# EAGLE design C=Key (EAGLE 4.13)
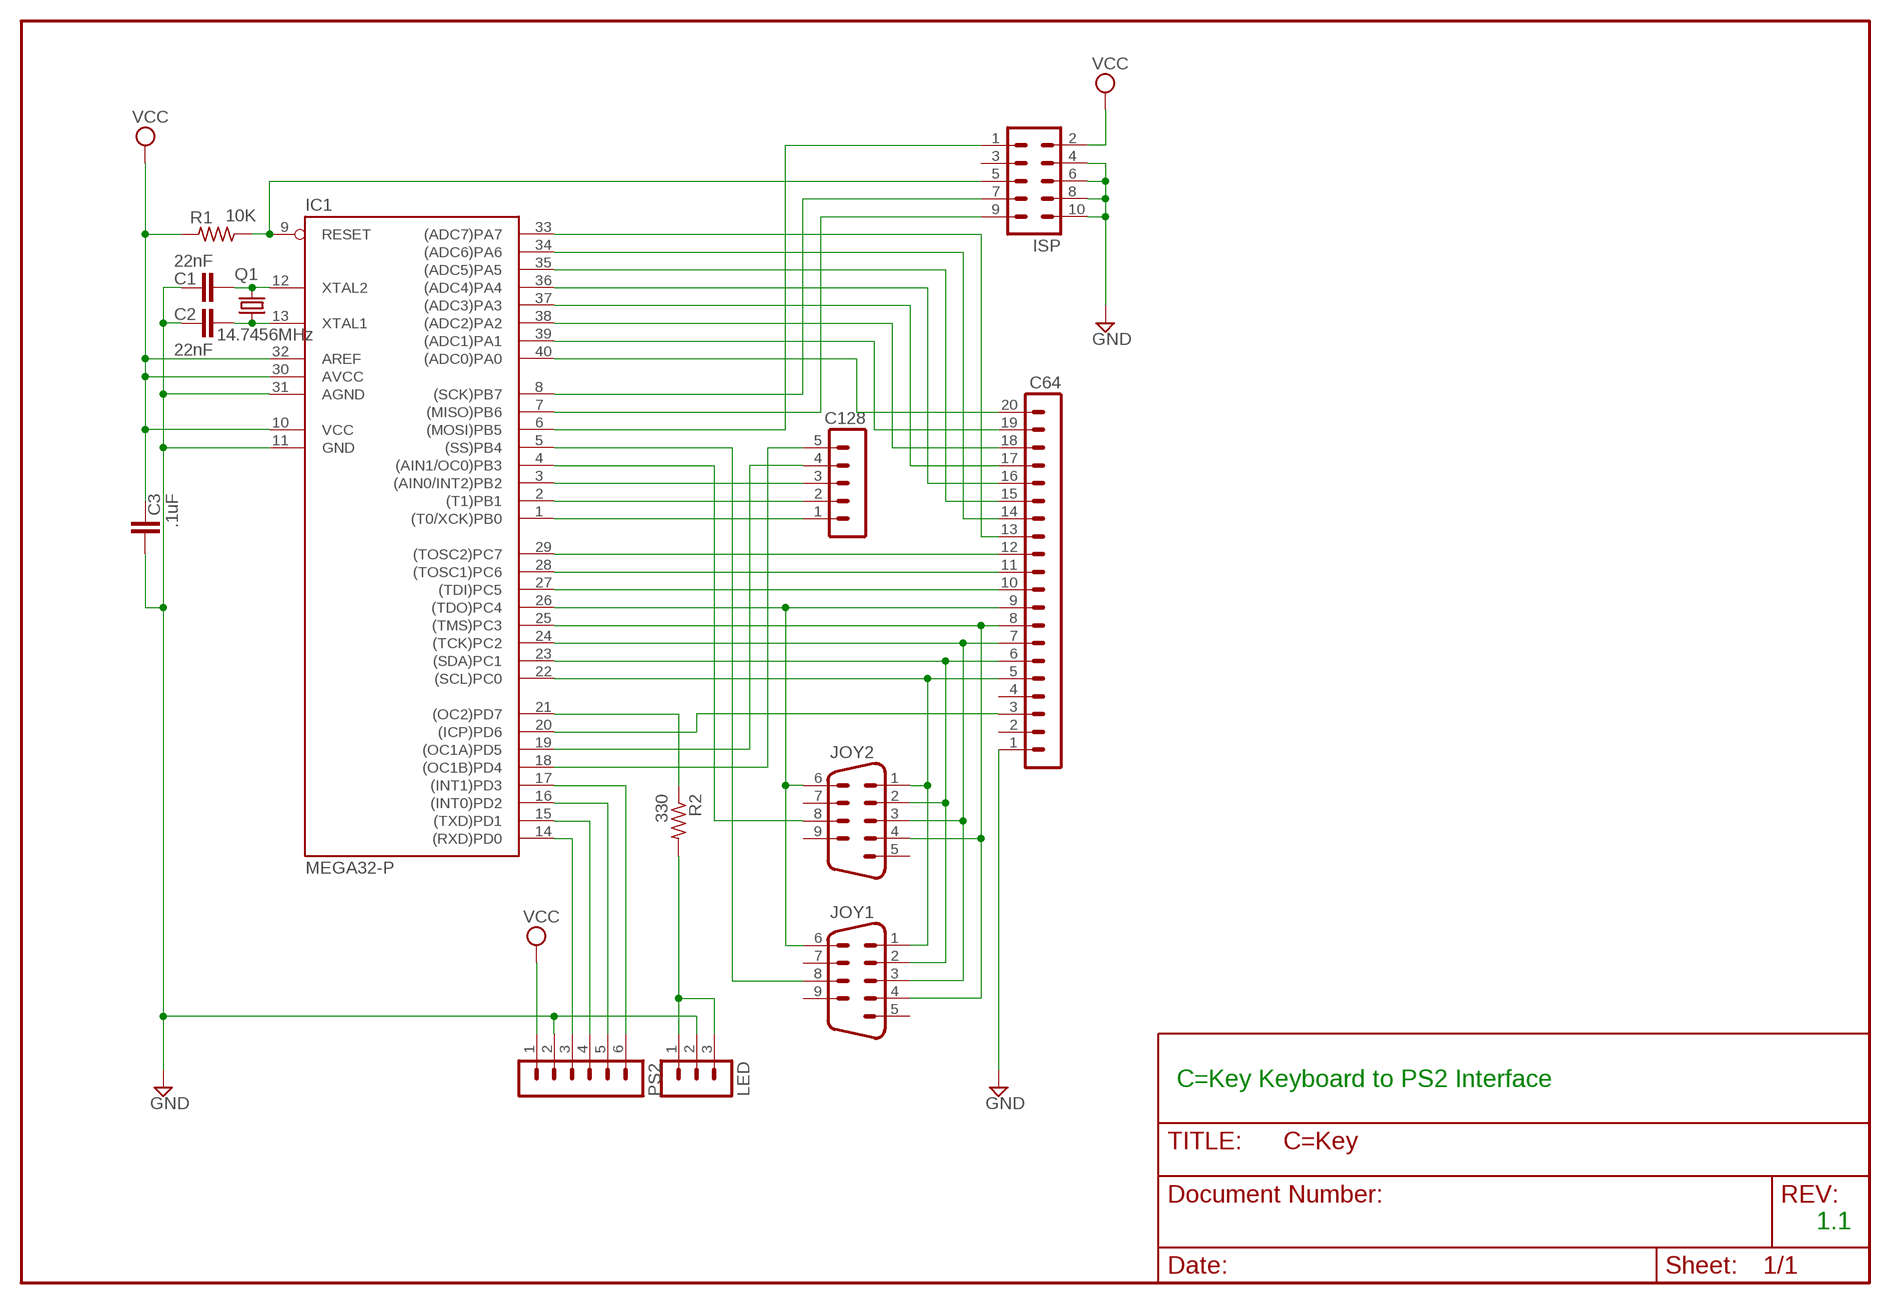
[diagram p0: schematic, sheet 1]

## Parts
C1  22nF  C2.5/2  [C2.5-2]
C2  22nF  C2.5/2  [C2.5-2]
C3  .1uF  C2.5/2  [C2.5-2]
C64  MA20-1  [MA20-1]
C128  MA05-1  [MA05-1]
IC1  MEGA32-P  [DIL40]
ISP  MA05-2  [MA05-2]
JOY1  M09H  [M09H]
JOY2  M09H  [M09H]
LED  MA03-1  [MA03-1]
PS2  MA06-1  [MA06-1]
Q1  14.7456MHz  CRYTALHC49U-V  [HC49U-V]
R1  10K  R-US_0613/5V  [P0613V]
R2  330  R-US_0613/5V  [P0613V]

## Nets
GND: C1.1 C2.1 C3.2 C64.1 IC1.11(GND) IC1.31(AGND) ISP.4 ISP.6 ISP.8 ISP.10 LED.2 PS2.2
N$1: C64.5 IC1.22((SCL)PC0) JOY1.1 JOY2.1
N$2: C64.6 IC1.23((SDA)PC1) JOY1.2 JOY2.2
N$3: C64.7 IC1.24((TCK)PC2) JOY1.3 JOY2.3
N$4: C64.8 IC1.25((TMS)PC3) JOY1.4 JOY2.4
N$5: C64.9 IC1.26((TDO)PC4) JOY1.6 JOY2.6
N$6: C64.10 IC1.27((TDI)PC5)
N$7: C64.11 IC1.28((TOSC1)PC6)
N$8: C64.12 IC1.29((TOSC2)PC7)
N$9: C64.13 IC1.33((ADC7)PA7)
N$10: C64.14 IC1.34((ADC6)PA6)
N$11: C64.15 IC1.35((ADC5)PA5)
N$12: C64.16 IC1.36((ADC4)PA4)
N$13: C64.17 IC1.37((ADC3)PA3)
N$14: C64.18 IC1.38((ADC2)PA2)
N$15: C64.19 IC1.39((ADC1)PA1)
N$16: C64.20 IC1.40((ADC0)PA0)
N$17: C128.1 IC1.1((T0/XCK)PB0)
N$18: C128.2 IC1.2((T1)PB1)
N$19: C128.3 IC1.3((AIN0/INT2)PB2)
N$20: IC1.4((AIN1/OC0)PB3) JOY2.8
N$21: IC1.5((SS)PB4) JOY1.8
N$22: IC1.14((RXD)PD0) PS2.3
N$23: IC1.15((TXD)PD1) PS2.4
N$24: IC1.16((INT0)PD2) PS2.5
N$25: IC1.17((INT1)PD3) PS2.6
N$26: C64.3 IC1.20((ICP)PD6)
N$27: C128.5 IC1.18((OC1B)PD4)
N$28: C128.4 IC1.19((OC1A)PD5)
N$29: IC1.9(RESET) ISP.5 R1.1
N$30: IC1.21((OC2)PD7) R2.1
N$31: C1.2 IC1.12(XTAL2) Q1.2
N$32: LED.1 LED.3 R2.2
N$34: C2.2 IC1.13(XTAL1) Q1.1
N$35: IC1.6((MOSI)PB5) ISP.1
N$36: IC1.8((SCK)PB7) ISP.7
N$37: IC1.7((MISO)PB6) ISP.9
VCC: C3.1 IC1.10(VCC) IC1.30(AVCC) IC1.32(AREF) ISP.2 PS2.1 R1.2
Unconnected: C64.2 C64.4 ISP.3 JOY1.5 JOY1.7 JOY1.9 JOY2.5 JOY2.7 JOY2.9

## Notes on the sheet
- C=Key Keyboard to PS2 Interface
- 1.1

## Library data of the parts
C1-C3 = capacitor-wima:C: CAPACITOR naming: grid - package width
C64 = con-lstb:MA20-1: PIN HEADER
C128 = con-lstb:MA05-1: PIN HEADER
IC1 = avr:MEGA32-P: MICROCONTROLLER 32 Kbytes FLASH 2 Kbytes SRAM 1 Kbytes EEPROM USART 8-channel 10 bit ADC
ISP = con-lstb:MA05-2: PIN HEADER
JOY1 JOY2 = con-subd:M09: SUB-D
LED = con-lstb:MA03-1: PIN HEADER
PS2 = con-lstb:MA06-1: PIN HEADER
Q1 = crystal:CRYTAL: CRYSTAL
R1 R2 = rcl:R-US_: RESISTOR, American symbol

## Board
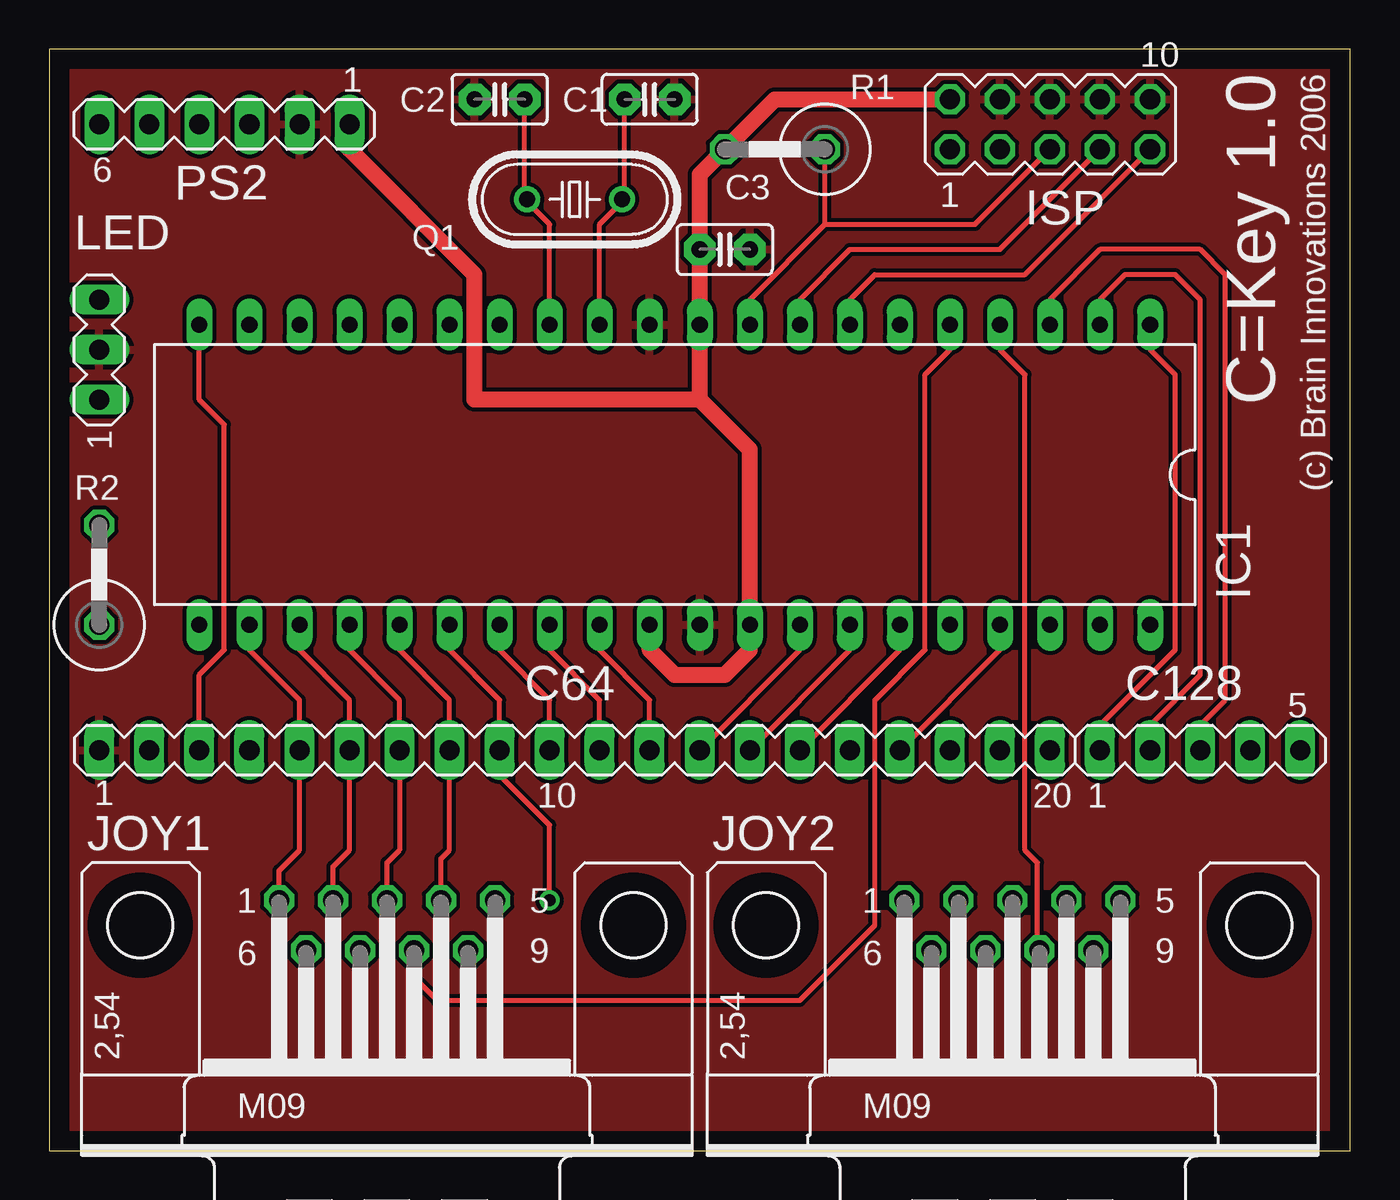
[diagram p1: board, top side]
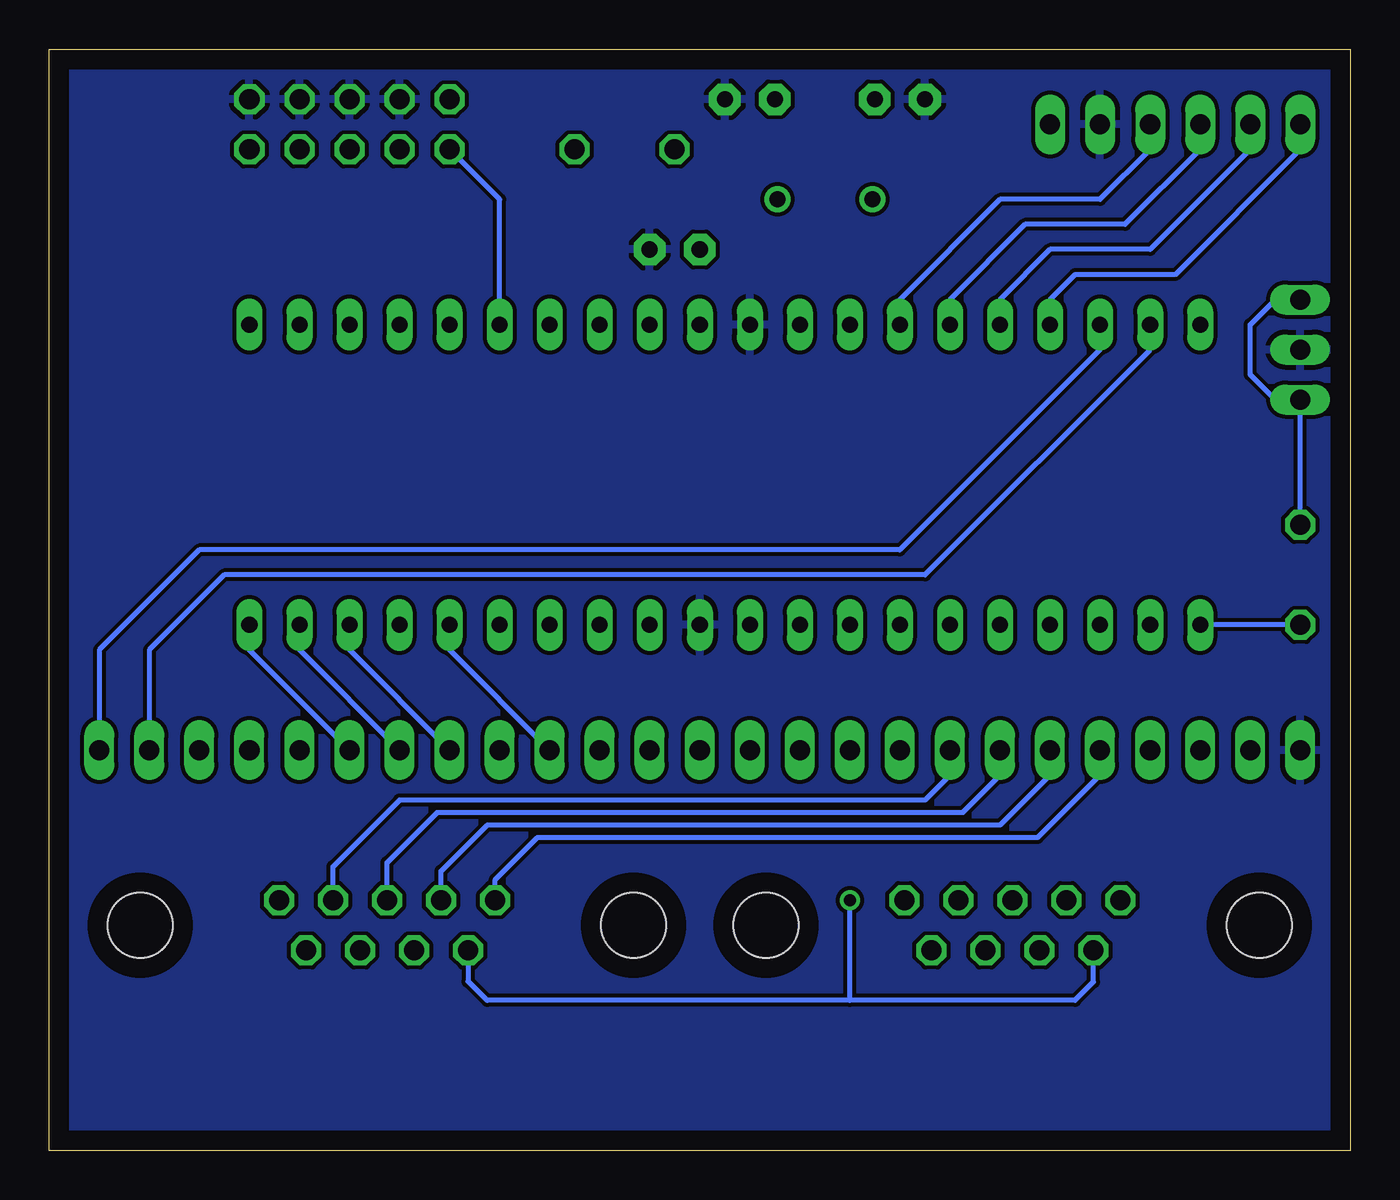
[diagram p2: board, bottom side, seen from below]

Size 66.04 x 55.88 mm. Coordinates in mm from the lower left corner, seen from the top.
Outline: 0,0 66.04,0 66.04,55.88 0,55.88 0,0
Copper layers (1*16): Top 0.035mm / dielectric 1.5mm / Bottom 0.035mm
Design rules "default": minimum track width 10mil, minimum drill 24mil, track to track 8mil, track to pad 8mil, pad to pad 8mil, via to via 8mil, smd to smd 8mil, copper to edge 40mil, drill to drill 8mil, minimum pad ring 10mil, minimum via ring 8mil, stop-mask expansion 4mil, vias tented up to drill 0mil, thermal gap 10mil

### Footprints (pad centres in the part's own frame; a part is rotated, then mirrored left to right if it is on the bottom)
C2.5-2 = drill 0.813 pad 1.6 octagon: 1 -1.27,0; 2 1.27,0
MA20-1 = drill 1.016 long: 1 -24.13,0; 2 -21.59,0; 3 -19.05,0; 4 -16.51,0; 5 -13.97,0; 6 -11.43,0; 7 -8.89,0; 8 -6.35,0; 9 -3.81,0; 10 -1.27,0; 11 1.27,0; 12 3.81,0; 13 6.35,0; 14 8.89,0; 15 11.43,0; 16 13.97,0; 17 16.51,0; 18 19.05,0; 19 21.59,0; 20 24.13,0
MA05-1 = drill 1.016 long: 1 -5.08,0; 2 -2.54,0; 3 0,0; 4 2.54,0; 5 5.08,0
DIL40 = drill 0.813 long: 1 -24.13,-7.62; 2 -21.59,-7.62; 3 -19.05,-7.62; 4 -16.51,-7.62; 5 -13.97,-7.62; 6 -11.43,-7.62; 7 -8.89,-7.62; 8 -6.35,-7.62; 9 -3.81,-7.62; 10 -1.27,-7.62; 11 1.27,-7.62; 12 3.81,-7.62; 13 6.35,-7.62; 14 8.89,-7.62; 15 11.43,-7.62; 16 13.97,-7.62; 17 16.51,-7.62; 18 19.05,-7.62; 19 21.59,-7.62; 20 24.13,-7.62; 21 24.13,7.62; 22 21.59,7.62; 23 19.05,7.62; 24 16.51,7.62; 25 13.97,7.62; 26 11.43,7.62; 27 8.89,7.62; 28 6.35,7.62; 29 3.81,7.62; 30 1.27,7.62; 31 -1.27,7.62; 32 -3.81,7.62; 33 -6.35,7.62; 34 -8.89,7.62; 35 -11.43,7.62; 36 -13.97,7.62; 37 -16.51,7.62; 38 -19.05,7.62; 39 -21.59,7.62; 40 -24.13,7.62
MA05-2 = drill 1.016 octagon: 1 -5.08,-1.27; 2 -5.08,1.27; 3 -2.54,-1.27; 4 -2.54,1.27; 5 0,-1.27; 6 0,1.27; 7 2.54,-1.27; 8 2.54,1.27; 9 5.08,-1.27; 10 5.08,1.27
M09H = drill 1.016 octagon: 1 -5.486,1.27; 2 -2.743,1.27; 3 0,1.27; 4 2.743,1.27; 5 5.486,1.27; 6 -4.115,-1.27; 7 -1.372,-1.27; 8 1.372,-1.27; 9 4.115,-1.27 | hole 3.302: 12.522,0; -12.522,0
MA03-1 = drill 1.016 long: 1 -2.54,0; 2 0,0; 3 2.54,0
MA06-1 = drill 1.016 long: 1 -6.35,0; 2 -3.81,0; 3 -1.27,0; 4 1.27,0; 5 3.81,0; 6 6.35,0
HC49U-V = drill 0.813 round: 1 -2.413,0; 2 2.413,0
P0613V = drill 1.016 octagon: 1 -2.54,0; 2 2.54,0

### Placement (x,y rotation side)
C1  30.48,53.34 180 top
C2  22.86,53.34 0 top
C3  34.29,45.72 0 top
C64  26.67,20.32 0 top
C128  58.42,20.32 0 top
IC1  31.75,34.29 180 top
ISP  50.8,52.07 0 top
JOY1  17.14,11.43 0 top
JOY2  48.9,11.43 0 top
LED  2.54,40.64 90 top
PS2  8.89,52.07 180 top
Q1  26.67,48.26 0 top
R1  36.83,50.8 180 top
R2  2.54,29.21 90 top

### Tracks (layer width: path | path; a pad name or v marks a point on that pad's centre or on a via)
GND
  pour Top: 0,55.88 66.04,55.88 66.04,0 0,0
  pour Bottom: 0,55.88 66.04,55.88 66.04,0 0,0
N$1
  Top 0.254: IC1.22 10.16,25.4 12.7,22.86 C64.5 12.7,15.24 11.66,14.2 JOY1.1
  Bottom 0.254: C64.5 12.7,19.05 15.88,15.88 40.01,15.88 41.27,15.88 43.41,13.74 JOY2.1
N$2
  Top 0.254: IC1.23 12.7,25.4 15.24,22.86 C64.6 15.24,15.24 14.4,14.4 JOY1.2
  Bottom 0.254: C64.6 15.24,19.05 17.78,16.51 43.81,16.51 46.15,14.17 JOY2.2
N$3
  Top 0.254: IC1.24 15.24,25.4 17.78,22.86 C64.7 17.78,15.24 17.14,14.61 JOY1.3
  Bottom 0.254: C64.7 17.78,19.05 19.68,17.14 46.35,17.14 48.9,14.61 JOY2.3
N$4
  Top 0.254: IC1.25 17.78,25.4 20.32,22.86 C64.8 20.32,15.24 19.89,14.81 JOY1.4
  Bottom 0.254: C64.8 20.32,19.05 21.59,17.78 48.26,17.78 51.64,14.4 JOY2.4
N$5  (via drill 0.61)
  Top 0.254: IC1.26 20.32,25.4 22.86,22.86 C64.9 22.86,19.05 25.4,16.51 v25.4,12.7
  Bottom 0.254: 25.4,7.62 v25.4,12.7 | JOY1.6 13.03,8.56 13.97,7.62 25.4,7.62 | JOY2.6 44.78,8.59 43.81,7.62 25.4,7.62
N$6
  Top 0.254: IC1.27 22.86,25.4 25.4,22.86 C64.10
N$7
  Top 0.254: C64.11 27.94,22.86 25.4,25.4 IC1.28
N$8
  Top 0.254: IC1.29 27.94,25.4 30.48,22.86 C64.12
N$9
  Top 0.254: IC1.33 38.1,25.4 C64.13
N$10
  Top 0.254: C64.14 40.64,25.4 IC1.34
N$11
  Top 0.254: IC1.35 43.18,25.4 C64.15
N$12
  Bottom 0.254: IC1.36 45.72,25.4 C64.16
N$13
  Top 0.254: C64.17 48.26,25.4 IC1.37
N$14
  Bottom 0.254: IC1.38 50.8,25.4 C64.18
N$15
  Bottom 0.254: C64.19 53.34,25.4 IC1.39
N$16
  Bottom 0.254: C64.20 55.88,25.4 IC1.40
N$17
  Top 0.254: IC1.1 55.88,40.64 57.15,39.37 57.15,25.4 53.34,21.59 C128.1
N$18
  Top 0.254: IC1.2 53.34,43.18 54.61,44.45 57.15,44.45 58.42,43.18 58.42,24.13 55.88,21.59 C128.2
N$19
  Top 0.254: IC1.3 50.8,43.18 53.34,45.72 58.42,45.72 59.69,44.45 59.69,22.86 58.42,21.59 C128.3
N$20
  Top 0.254: IC1.4 48.26,40.64 49.53,39.37 49.53,15.24 50.16,14.61 50.16,10.16 JOY2.8
N$21
  Top 0.254: IC1.5 45.72,40.64 44.45,39.37 44.45,25.4 41.91,22.86 41.91,11.43 38.1,7.62 19.68,7.62 18.52,8.79 JOY1.8
N$22
  Bottom 0.254: IC1.14 22.86,43.18 17.78,48.26 12.7,48.26 10.16,50.8 PS2.3
N$23
  Bottom 0.254: IC1.15 20.32,43.18 16.51,46.99 11.43,46.99 7.62,50.8 PS2.4
N$24
  Bottom 0.254: IC1.16 17.78,43.18 15.24,45.72 10.16,45.72 5.08,50.8 PS2.5
N$25
  Bottom 0.254: IC1.17 15.24,43.18 13.97,44.45 8.89,44.45 2.54,50.8 PS2.6
N$26
  Top 0.254: C64.3 7.62,24.13 8.89,25.4 8.89,36.83 7.62,38.1 IC1.20
N$27
  Bottom 0.254: C128.5 63.5,25.4 58.42,30.48 22.86,30.48 12.7,40.64 IC1.18
N$28
  Bottom 0.254: C128.4 60.96,25.4 57.15,29.21 21.59,29.21 10.16,40.64 IC1.19
N$29
  Top 0.254: IC1.9 35.56,43.18 39.37,46.99 | 39.37,46.99 R1.1 | ISP.5 46.99,46.99 39.37,46.99
N$30
  Bottom 0.254: R2.1 IC1.21
N$31
  Top 0.254: IC1.12 27.94,46.99 29.08,48.13 Q1.2 29.21,48.26 C1.2
N$32
  Bottom 0.254: R2.2 LED.1 3.81,38.1 5.08,39.37 5.08,41.91 3.81,43.18 LED.3
N$34
  Top 0.254: 24.13,48.26 25.4,46.99 IC1.13 | 24.13,48.26 C2.2 | 24.13,48.26 Q1.1
N$35
  Bottom 0.254: IC1.6 43.18,48.26 ISP.1
N$36
  Top 0.254: ISP.7 48.26,45.72 40.64,45.72 38.1,43.18 IC1.8
N$37
  Top 0.254: IC1.7 40.64,43.18 41.91,44.45 49.53,44.45 ISP.9
VCC
  Top 0.813: IC1.30 30.48,25.4 31.75,24.13 34.29,24.13 35.56,25.4 IC1.32 35.56,35.56 33.02,38.1 | 33.02,38.1 IC1.10 C3.1 33.02,49.53 R1.2 36.83,53.34 ISP.2 | PS2.1 15.24,50.8 21.59,44.45 21.59,38.1 33.02,38.1

### Text on the board
tPlace: C=Key 1.0 | (c) Brain Innovations 2006